# EAGLE design remote-connection-board (EAGLE 6.4)
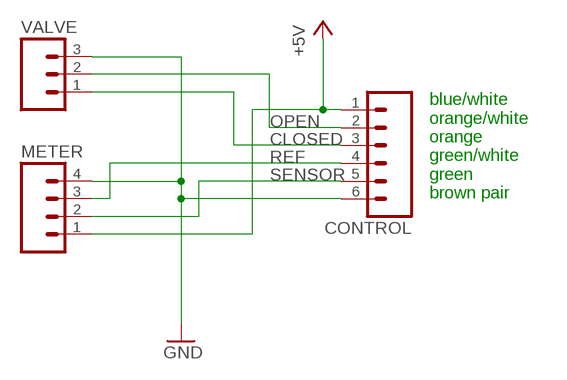
[diagram p0: schematic, sheet 1]

## Parts
CONTROL  M06  [06P]
METER  M04  [04P]
VALVE  M03  [03P]

## Nets
+5V: CONTROL.1 METER.1
CLOSED: CONTROL.3 VALVE.1
GND: CONTROL.6 METER.4 VALVE.3
OPEN: CONTROL.2 VALVE.2
REF: CONTROL.4 METER.3
SENSOR: CONTROL.5 METER.2

## Notes on the sheet
- blue/white
  orange/white
  orange
  green/white
  green
  brown pair

## Library data of the parts
CONTROL = con-amp-quick:M06: AMP QUICK CONNECTOR; OC_FARNELL: unknown; OC_NEWARK: unknown
METER = con-amp-quick:M04: AMP QUICK CONNECTOR; OC_FARNELL: unknown; OC_NEWARK: unknown
VALVE = con-amp-quick:M03: AMP QUICK CONNECTOR; OC_FARNELL: unknown; OC_NEWARK: unknown

## Board
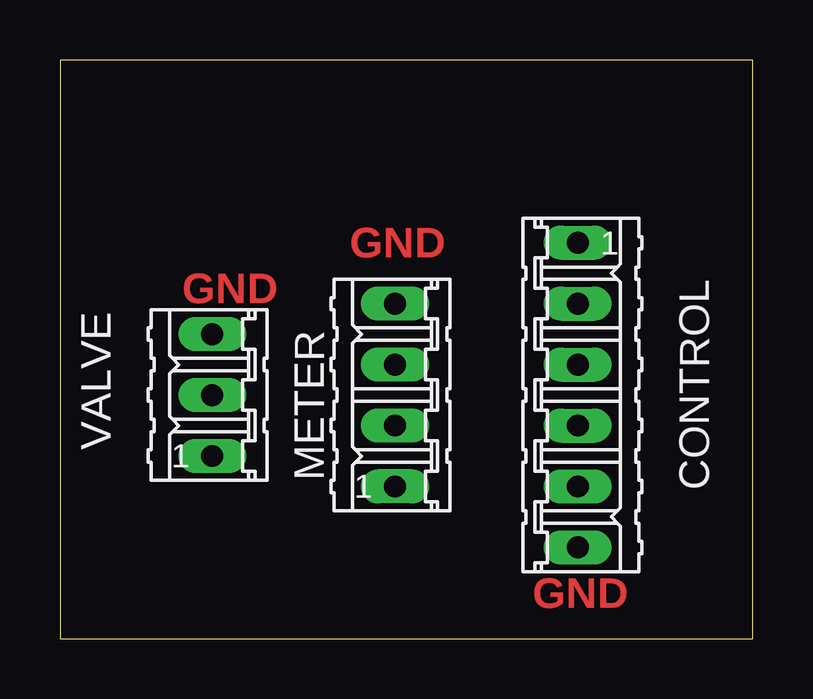
[diagram p1: board, top side]
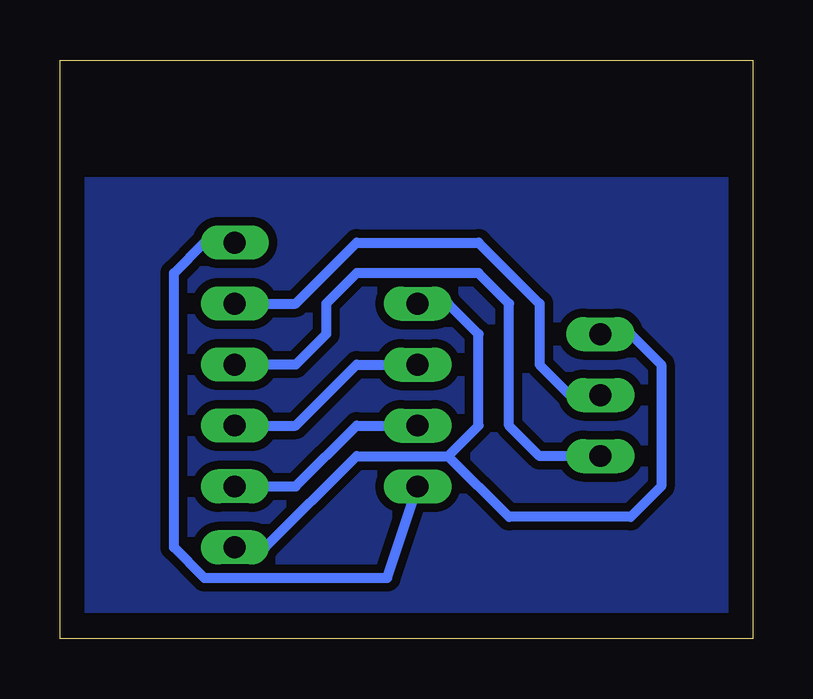
[diagram p2: board, bottom side, seen from below]

Size 28.88 x 24.12 mm. Coordinates in mm from the lower left corner, seen from the top.
Outline: 0,0 28.88,0 28.88,24.12 0,24.12 0,0
Copper layers (1*16): Top 0.035mm / dielectric 1.5mm / Bottom 0.035mm
Design rules "default *": minimum track width 10mil, minimum drill 24mil, track to track 14mil, track to pad 14mil, pad to pad 14mil, via to via 14mil, smd to smd 14mil, copper to edge 40mil, drill to drill 8mil, minimum pad ring 10mil, minimum via ring 8mil, stop-mask expansion 4mil, vias tented up to drill 0mil, thermal gap 10mil

### Footprints (pad centres in the part's own frame; a part is rotated, then mirrored left to right if it is on the bottom)
06P = drill 0.914 long: 1 -6.35,0; 2 -3.81,0; 3 -1.27,0; 4 1.27,0; 5 3.81,0; 6 6.35,0
04P = drill 0.914 long: 1 -3.81,0; 2 -1.27,0; 3 1.27,0; 4 3.81,0
03P = drill 0.914 long: 1 -2.54,0; 2 0,0; 3 2.54,0

### Placement (x,y rotation side)
CONTROL  21.59,10.16 270 top
METER  13.97,10.16 90 top
VALVE  6.35,10.16 90 top

### Tracks (layer width: path | path; a pad name or v marks a point on that pad's centre or on a via)
+5V
  Bottom 0.406: CONTROL.1 22.86,16.51 24.13,15.24 24.13,3.81 22.86,2.54 15.24,2.54 METER.1
CLOSED
  Bottom 0.406: VALVE.1 8.89,7.62 10.16,8.89 10.16,13.97 11.43,15.24 16.51,15.24 17.78,13.97 17.78,12.7 19.05,11.43 CONTROL.3
GND
  Bottom 0.406: CONTROL.6 20.32,3.81 16.51,7.62 12.7,7.62 | 12.7,7.62 11.43,8.89 11.43,12.7 12.7,13.97 METER.4 | VALVE.3 5.08,12.7 3.81,11.43 3.81,6.35 5.08,5.08 10.16,5.08 12.7,7.62
N$1
  pour Bottom: 0,1.27 27.94,1.27 27.94,19.05 0,19.05
OPEN
  Bottom 0.406: CONTROL.2 19.05,13.97 16.51,16.51 11.43,16.51 8.89,13.97 8.89,11.43 7.62,10.16 VALVE.2
REF
  Bottom 0.406: CONTROL.4 19.05,8.89 16.51,11.43 METER.3
SENSOR
  Bottom 0.406: CONTROL.5 19.05,6.35 16.51,8.89 METER.2

### Text on the board
Top: GND | GND | GND